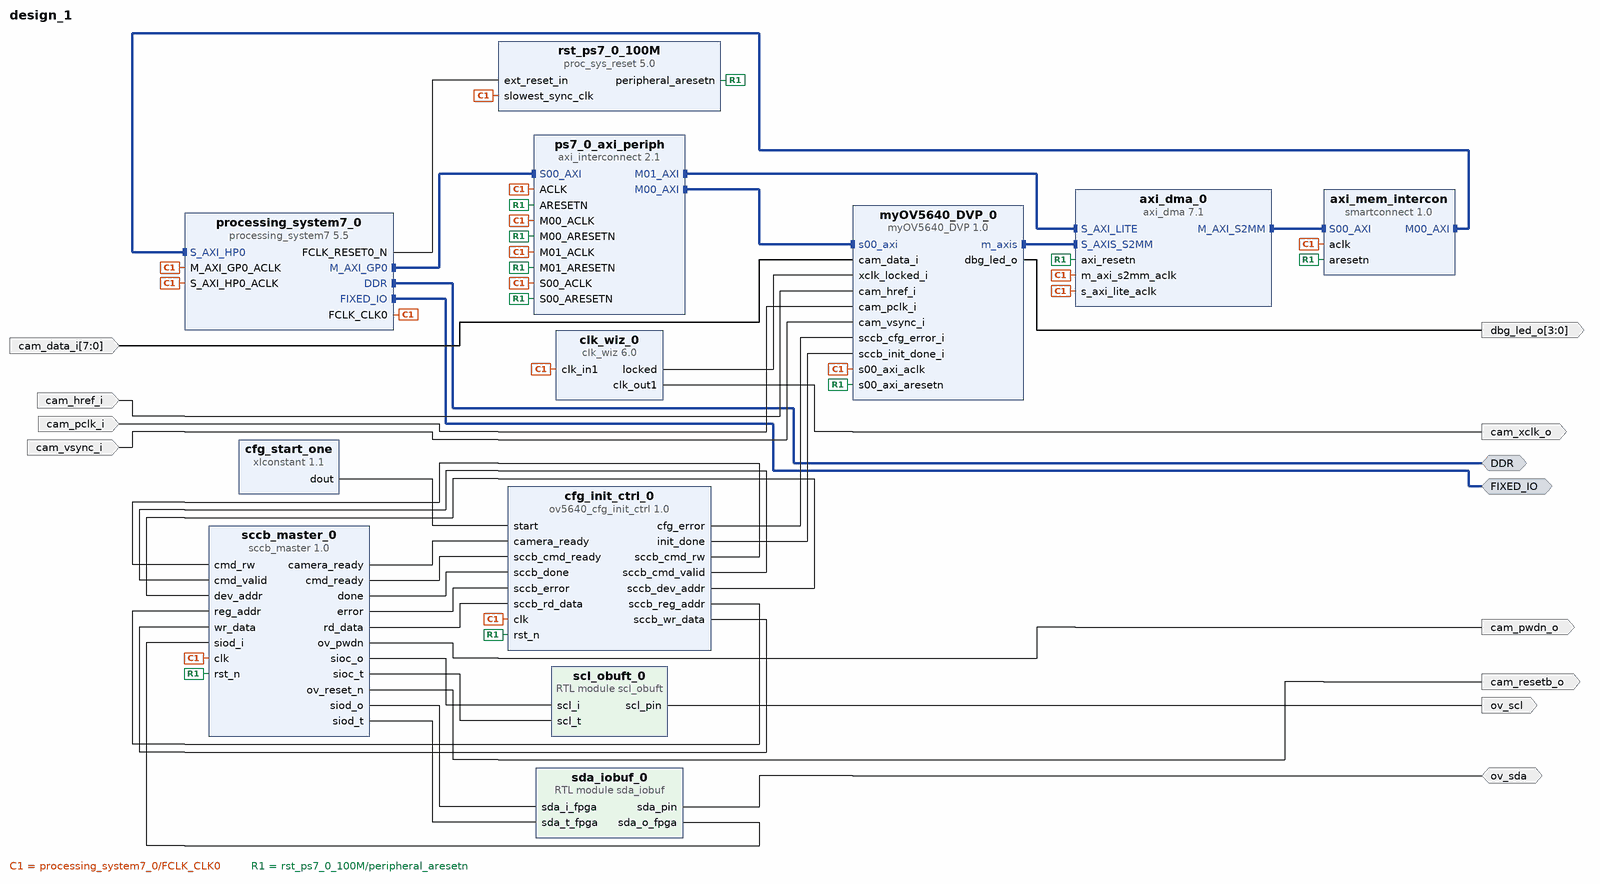
[diagram p0: block diagram of the top level]
# Vivado block design design_1, xc7z020clg400-1, Vivado 2023.2
create_bd_design design_1

create_bd_intf_port -mode Master -vlnv xilinx.com:interface:ddrx_rtl:1.0 DDR
create_bd_intf_port -mode Master -vlnv xilinx.com:display_processing_system7:fixedio_rtl:1.0 FIXED_IO
create_bd_port -dir I -from 7 -to 0 cam_data_i
create_bd_port -dir I cam_pclk_i
create_bd_port -dir I cam_href_i
create_bd_port -dir I cam_vsync_i
create_bd_port -dir O cam_xclk_o
create_bd_port -dir O cam_resetb_o
create_bd_port -dir O cam_pwdn_o
create_bd_port -dir O -from 3 -to 0 dbg_led_o
create_bd_port -dir O ov_scl
create_bd_port -dir IO ov_sda

create_bd_cell -type ip -vlnv xilinx.com:ip:processing_system7:5.5 processing_system7_0
set_property -dict [list \
  CONFIG.PCW_APU_PERIPHERAL_FREQMHZ 650 \
  CONFIG.PCW_CRYSTAL_PERIPHERAL_FREQMHZ 50 \
  CONFIG.PCW_ENET0_ENET0_IO {MIO 16 .. 27} \
  CONFIG.PCW_ENET0_GRP_MDIO_ENABLE 1 \
  CONFIG.PCW_ENET0_GRP_MDIO_IO {MIO 52 .. 53} \
  CONFIG.PCW_ENET0_PERIPHERAL_ENABLE 1 \
  CONFIG.PCW_ENET0_RESET_ENABLE 1 \
  CONFIG.PCW_ENET0_RESET_IO {MIO 9} \
  CONFIG.PCW_ENET_RESET_ENABLE 1 \
  CONFIG.PCW_ENET_RESET_SELECT {Share reset pin} \
  CONFIG.PCW_FPGA0_PERIPHERAL_FREQMHZ 100 \
  CONFIG.PCW_FPGA1_PERIPHERAL_FREQMHZ 50 \
  CONFIG.PCW_GPIO_MIO_GPIO_ENABLE 1 \
  CONFIG.PCW_GPIO_MIO_GPIO_IO MIO \
  CONFIG.PCW_I2C_RESET_ENABLE 1 \
  CONFIG.PCW_PERIPHERAL_BOARD_PRESET None \
  CONFIG.PCW_PRESET_BANK1_VOLTAGE {LVCMOS 1.8V} \
  CONFIG.PCW_QSPI_GRP_FBCLK_ENABLE 1 \
  CONFIG.PCW_QSPI_GRP_FBCLK_IO {MIO 8} \
  CONFIG.PCW_QSPI_GRP_SINGLE_SS_ENABLE 1 \
  CONFIG.PCW_QSPI_GRP_SINGLE_SS_IO {MIO 1 .. 6} \
  CONFIG.PCW_QSPI_PERIPHERAL_ENABLE 1 \
  CONFIG.PCW_QSPI_QSPI_IO {MIO 1 .. 6} \
  CONFIG.PCW_SD0_GRP_CD_ENABLE 1 \
  CONFIG.PCW_SD0_GRP_CD_IO {MIO 47} \
  CONFIG.PCW_SD0_GRP_WP_ENABLE 0 \
  CONFIG.PCW_SD0_PERIPHERAL_ENABLE 1 \
  CONFIG.PCW_SD0_SD0_IO {MIO 40 .. 45} \
  CONFIG.PCW_SDIO_PERIPHERAL_FREQMHZ 50 \
  CONFIG.PCW_SINGLE_QSPI_DATA_MODE x4 \
  CONFIG.PCW_S_AXI_HP0_DATA_WIDTH 32 \
  CONFIG.PCW_UART0_PERIPHERAL_ENABLE 1 \
  CONFIG.PCW_UART0_UART0_IO {MIO 14 .. 15} \
  CONFIG.PCW_UART1_PERIPHERAL_ENABLE 0 \
  CONFIG.PCW_UART_PERIPHERAL_FREQMHZ 100 \
  CONFIG.PCW_UIPARAM_DDR_BUS_WIDTH {16 Bit} \
  CONFIG.PCW_UIPARAM_DDR_FREQ_MHZ 525 \
  CONFIG.PCW_UIPARAM_DDR_PARTNO {MT41J256M16 RE-125} \
  CONFIG.PCW_USB0_PERIPHERAL_ENABLE 1 \
  CONFIG.PCW_USB0_RESET_ENABLE 1 \
  CONFIG.PCW_USB0_RESET_IO {MIO 46} \
  CONFIG.PCW_USB0_USB0_IO {MIO 28 .. 39} \
  CONFIG.PCW_USB_RESET_ENABLE 1 \
  CONFIG.PCW_USB_RESET_SELECT {Share reset pin} \
  CONFIG.PCW_USE_S_AXI_HP0 1 \
] [get_bd_cells processing_system7_0]
# 491 more settings of processing_system7_0 are not shown: defaults, MIO pin electricals, DDR timing, and values the tool derives
create_bd_cell -type ip -vlnv xilinx.com:ip:axi_interconnect:2.1 ps7_0_axi_periph
set_property -dict {CONFIG.NUM_MI 2} [get_bd_cells ps7_0_axi_periph]
create_bd_cell -type ip -vlnv xilinx.com:ip:proc_sys_reset:5.0 rst_ps7_0_100M
create_bd_cell -type ip -vlnv xilinx.com:user:myOV5640_DVP:1.0 myOV5640_DVP_0
create_bd_cell -type ip -vlnv xilinx.com:ip:clk_wiz:6.0 clk_wiz_0
set_property -dict [list \
  CONFIG.CLKOUT1_REQUESTED_OUT_FREQ 24.000 \
  CONFIG.PRIM_IN_FREQ 100.000 \
  CONFIG.PRIM_SOURCE No_buffer \
  CONFIG.USE_LOCKED true \
  CONFIG.USE_RESET false \
] [get_bd_cells clk_wiz_0]
create_bd_cell -type ip -vlnv bjut_group3_wyf:user:sccb_master:1.0 sccb_master_0
create_bd_cell -type ip -vlnv bjut_group3_wyf:user:ov5640_cfg_init_ctrl:1.0 cfg_init_ctrl_0
create_bd_cell -type ip -vlnv xilinx.com:ip:xlconstant:1.1 cfg_start_one
set_property -dict {CONFIG.CONST_VAL 1 CONFIG.CONST_WIDTH 1} [get_bd_cells cfg_start_one]
create_bd_cell -type module -reference sda_iobuf sda_iobuf_0
create_bd_cell -type module -reference scl_obuft scl_obuft_0
create_bd_cell -type ip -vlnv xilinx.com:ip:smartconnect:1.0 axi_mem_intercon
set_property -dict {CONFIG.NUM_MI 1 CONFIG.NUM_SI 1} [get_bd_cells axi_mem_intercon]
create_bd_cell -type ip -vlnv xilinx.com:ip:axi_dma:7.1 axi_dma_0
set_property -dict [list \
  CONFIG.c_include_mm2s 0 \
  CONFIG.c_include_s2mm 1 \
  CONFIG.c_include_sg 0 \
  CONFIG.c_m_axi_s2mm_data_width 32 \
  CONFIG.c_s2mm_burst_size 16 \
  CONFIG.c_s_axis_s2mm_tdata_width 16 \
] [get_bd_cells axi_dma_0]

# ---- connections ----

connect_bd_intf_net [get_bd_intf_pins axi_dma_0/M_AXI_S2MM] [get_bd_intf_pins axi_mem_intercon/S00_AXI]
connect_bd_intf_net [get_bd_intf_pins axi_mem_intercon/M00_AXI] [get_bd_intf_pins processing_system7_0/S_AXI_HP0]
connect_bd_intf_net [get_bd_intf_pins myOV5640_DVP_0/m_axis] [get_bd_intf_pins axi_dma_0/S_AXIS_S2MM]
connect_bd_intf_net [get_bd_intf_ports DDR] [get_bd_intf_pins processing_system7_0/DDR]
connect_bd_intf_net [get_bd_intf_ports FIXED_IO] [get_bd_intf_pins processing_system7_0/FIXED_IO]
connect_bd_intf_net [get_bd_intf_pins processing_system7_0/M_AXI_GP0] [get_bd_intf_pins ps7_0_axi_periph/S00_AXI]
connect_bd_intf_net [get_bd_intf_pins ps7_0_axi_periph/M00_AXI] [get_bd_intf_pins myOV5640_DVP_0/s00_axi]
connect_bd_intf_net [get_bd_intf_pins ps7_0_axi_periph/M01_AXI] [get_bd_intf_pins axi_dma_0/S_AXI_LITE]
connect_bd_net [get_bd_ports ov_sda] [get_bd_pins sda_iobuf_0/sda_pin]
connect_bd_net [get_bd_ports cam_data_i] [get_bd_pins myOV5640_DVP_0/cam_data_i]
connect_bd_net [get_bd_ports cam_href_i] [get_bd_pins myOV5640_DVP_0/cam_href_i]
connect_bd_net [get_bd_ports cam_pclk_i] [get_bd_pins myOV5640_DVP_0/cam_pclk_i]
connect_bd_net [get_bd_ports cam_vsync_i] [get_bd_pins myOV5640_DVP_0/cam_vsync_i]
connect_bd_net [get_bd_pins cfg_init_ctrl_0/cfg_error] [get_bd_pins myOV5640_DVP_0/sccb_cfg_error_i]
connect_bd_net [get_bd_pins cfg_init_ctrl_0/init_done] [get_bd_pins myOV5640_DVP_0/sccb_init_done_i]
connect_bd_net [get_bd_pins cfg_init_ctrl_0/sccb_cmd_rw] [get_bd_pins sccb_master_0/cmd_rw]
connect_bd_net [get_bd_pins cfg_init_ctrl_0/sccb_cmd_valid] [get_bd_pins sccb_master_0/cmd_valid]
connect_bd_net [get_bd_pins cfg_init_ctrl_0/sccb_dev_addr] [get_bd_pins sccb_master_0/dev_addr]
connect_bd_net [get_bd_pins cfg_init_ctrl_0/sccb_reg_addr] [get_bd_pins sccb_master_0/reg_addr]
connect_bd_net [get_bd_pins cfg_init_ctrl_0/sccb_wr_data] [get_bd_pins sccb_master_0/wr_data]
connect_bd_net [get_bd_pins cfg_start_one/dout] [get_bd_pins cfg_init_ctrl_0/start]
connect_bd_net [get_bd_pins clk_wiz_0/clk_out1] [get_bd_ports cam_xclk_o]
connect_bd_net [get_bd_pins clk_wiz_0/locked] [get_bd_pins myOV5640_DVP_0/xclk_locked_i]
connect_bd_net [get_bd_pins myOV5640_DVP_0/dbg_led_o] [get_bd_ports dbg_led_o]
connect_bd_net [get_bd_pins processing_system7_0/FCLK_CLK0] \
  [get_bd_pins processing_system7_0/M_AXI_GP0_ACLK] [get_bd_pins ps7_0_axi_periph/ACLK] \
  [get_bd_pins ps7_0_axi_periph/S00_ACLK] [get_bd_pins ps7_0_axi_periph/M00_ACLK] [get_bd_pins ps7_0_axi_periph/M01_ACLK] \
  [get_bd_pins rst_ps7_0_100M/slowest_sync_clk] [get_bd_pins myOV5640_DVP_0/s00_axi_aclk] [get_bd_pins clk_wiz_0/clk_in1] \
  [get_bd_pins sccb_master_0/clk] [get_bd_pins cfg_init_ctrl_0/clk] [get_bd_pins axi_dma_0/m_axi_s2mm_aclk] \
  [get_bd_pins axi_dma_0/s_axi_lite_aclk] [get_bd_pins axi_mem_intercon/aclk] \
  [get_bd_pins processing_system7_0/S_AXI_HP0_ACLK]
connect_bd_net [get_bd_pins processing_system7_0/FCLK_RESET0_N] [get_bd_pins rst_ps7_0_100M/ext_reset_in]
connect_bd_net [get_bd_pins rst_ps7_0_100M/peripheral_aresetn] \
  [get_bd_pins ps7_0_axi_periph/ARESETN] [get_bd_pins ps7_0_axi_periph/S00_ARESETN] \
  [get_bd_pins ps7_0_axi_periph/M00_ARESETN] [get_bd_pins ps7_0_axi_periph/M01_ARESETN] \
  [get_bd_pins myOV5640_DVP_0/s00_axi_aresetn] [get_bd_pins sccb_master_0/rst_n] [get_bd_pins cfg_init_ctrl_0/rst_n] \
  [get_bd_pins axi_dma_0/axi_resetn] [get_bd_pins axi_mem_intercon/aresetn]
connect_bd_net [get_bd_pins sccb_master_0/camera_ready] [get_bd_pins cfg_init_ctrl_0/camera_ready]
connect_bd_net [get_bd_pins sccb_master_0/cmd_ready] [get_bd_pins cfg_init_ctrl_0/sccb_cmd_ready]
connect_bd_net [get_bd_pins sccb_master_0/done] [get_bd_pins cfg_init_ctrl_0/sccb_done]
connect_bd_net [get_bd_pins sccb_master_0/error] [get_bd_pins cfg_init_ctrl_0/sccb_error]
connect_bd_net [get_bd_pins sccb_master_0/ov_pwdn] [get_bd_ports cam_pwdn_o]
connect_bd_net [get_bd_pins sccb_master_0/ov_reset_n] [get_bd_ports cam_resetb_o]
connect_bd_net [get_bd_pins sccb_master_0/rd_data] [get_bd_pins cfg_init_ctrl_0/sccb_rd_data]
connect_bd_net [get_bd_pins sccb_master_0/sioc_o] [get_bd_pins scl_obuft_0/scl_i]
connect_bd_net [get_bd_pins sccb_master_0/sioc_t] [get_bd_pins scl_obuft_0/scl_t]
connect_bd_net [get_bd_pins sccb_master_0/siod_o] [get_bd_pins sda_iobuf_0/sda_i_fpga]
connect_bd_net [get_bd_pins sccb_master_0/siod_t] [get_bd_pins sda_iobuf_0/sda_t_fpga]
connect_bd_net [get_bd_pins scl_obuft_0/scl_pin] [get_bd_ports ov_scl]
connect_bd_net [get_bd_pins sda_iobuf_0/sda_o_fpga] [get_bd_pins sccb_master_0/siod_i]

# ---- address map ----
assign_bd_address -offset 0x00000000 -range 512M -target_address_space [get_bd_addr_spaces axi_dma_0/Data_S2MM] [get_bd_addr_segs processing_system7_0/S_AXI_HP0/HP0_DDR_LOWOCM]
assign_bd_address -offset 0x40000000 -range 4K -target_address_space [get_bd_addr_spaces processing_system7_0/Data] [get_bd_addr_segs myOV5640_DVP_0/s00_axi/reg0]
assign_bd_address -offset 0x40400000 -range 64K -target_address_space [get_bd_addr_spaces processing_system7_0/Data] [get_bd_addr_segs axi_dma_0/S_AXI_LITE/Reg]

validate_bd_design
save_bd_design
